# Altium project H05R2x.PrjPcb (part 2 of 2)

## Sheet H05R2x_Frontend 1.SchDoc
size Letter; CompanyName: Hexabitz; DocumentNumber: 2; SheetNumber: 2; SheetTotal: 3
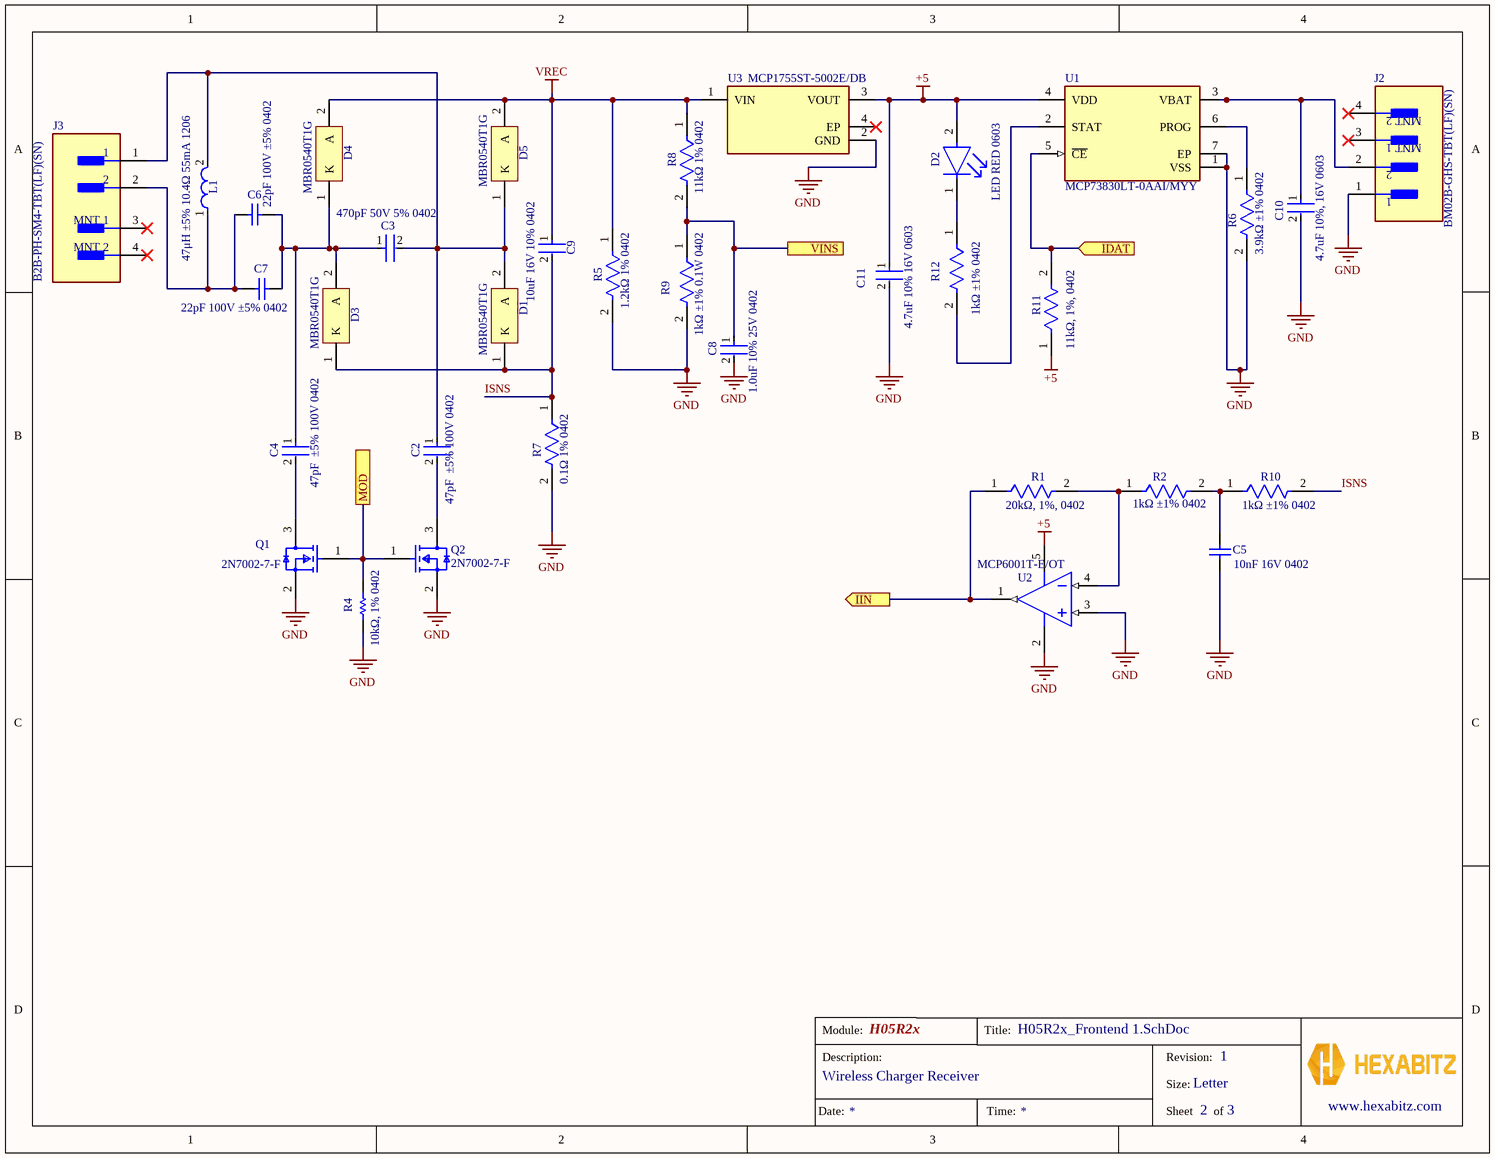
[diagram p1: H05R2x_Frontend 1.SchDoc]

### Parts
C2  47pF  ±5% 100V 0402  [FP-GQM155-0_05-IPC_A]
C3  470pF 50V 5% 0402  [FP-C0402-BB-MFG]
C4  47pF  ±5% 100V 0402  [FP-GQM155-0_05-IPC_A]
C5  10nF 16V 0402  [CAPC1005X60X26LL10T16]
C6  22pF 100V ±5% 0402  [CAPC1005X61X26LL10T16]
C7  22pF 100V ±5% 0402  [CAPC1005X61X26LL10T16]
C8  1.0uF 10% 25V 0402  [FP-GRM155-0_05-IPC_C]
C9  10uF 16V 10% 0402  [FP-GRM21B-0_1-IPC_B]
C10  4.7uF 10%, 16V 0603  [FP-GRM188-0_2-IPC_A]
C11  4.7uF 10% 16V 0603  [FP-GRM188-0_2-IPC_A]
D1  MBR0540T1G  [ONSC-SOD-123-2-425-04_V]
D2  LED RED 0603  [FP-6_541-5092_01-4-MFG]
D3  MBR0540T1G  [ONSC-SOD-123-2-425-04_V]
D4  MBR0540T1G  [ONSC-SOD-123-2-425-04_V]
D5  MBR0540T1G  [ONSC-SOD-123-2-425-04_V]
J2  BM02B-GHS-TBT(LF)(SN)  [FP-BM02B-GHS-TBT_LF_SN-MFG]
J3  B2B-PH-SM4-TBT(LF)(SN)  [FP-B2B-PH-SM4-TBT_LF_SN-MFG]
L1  47μH ±5% 10.4Ω 55mA 1206  [FP-LQH31CN_03-MFG]
Q1  2N7002-7-F  [FP-SOT23-MFG]
Q2  2N7002-7-F  [FP-SOT23-MFG]
R1  20kΩ, 1%, 0402  [FP-TFCR0402-IPC_A]
R2  1kΩ ±1% 0402  [FP-RNCP0402-IPC_C]
R4  10kΩ, 1% 0402  [RESC1005X40X25LL10T10]
R5  1.2kΩ 1% 0402  [FP-MCS0402-IPC_C]
R6  3.9kΩ ±1% 0402  [FP-RN73R1E-IPC_C]
R7  0.1Ω 1% 0402  [FP-CSR0402-IPC_A]
R8  11kΩ 1% 0402  [FP-CRCW0402-e3-IPC_B]
R9  1kΩ ±1% 0.1W 0402  [FP-RNCP0402-IPC_C]
R10  1kΩ ±1% 0402  [FP-RNCP0402-IPC_C]
R11  11kΩ, 1%, 0402  [FP-CRCW0402-e3-IPC_B]
R12  1kΩ ±1% 0402  [FP-AC0402-IPC_C]
U1  MCP73830LT-0AAI/MYY  [FP-C04-078-IPC_C]
U2  MCP6001T-E/OT  [SOT-23-OT5_L]
U3  MCP1755ST-5002E/DB  [FP-C04-032-IPC_B]

### Ports
IDAT (in), IIN (out), MOD, VINS

### Nets
+5: C11.1 D2.2(A) R11.1 U1.4(VDD) U2.5(VDD) U3.3(VOUT)
GND: C5.2 C8.2 C10.2 C11.2 J2.1 Q1.2(S) Q2.2(S) R4.1 R5.2 R6.2 R7.2 R9.2 U1.1(VSS) U1.7(EP) U2.2(VSS) U2.3(VIN+) U3.2(GND)
VREC: C9.1 D4.2(A) D5.2(A) R5.1 R8.1 U3.1(VIN)
ISNS: C9.2 D1.1(K) D3.1(K) R7.1 R10.2
NetC2_1: C2.1 C3.2 D1.2(A) D5.1(K) J3.1 L1.2
NetC2_2: C2.2 Q2.3(D)
NetC3_1: C3.1 C4.1 C6.2 C7.2 D3.2(A) D4.1(K)
NetC4_2: C4.2 Q1.3(D)
NetC5_1: C5.1 R2.2 R10.1
NetC6_1: C6.1 C7.1 J3.2 L1.1
NetC8_1: C8.1 R8.2 R9.1 ; port VINS
NetC10_1: C10.1 J2.2 U1.3(VBAT)
NetD2_1: D2.1(C) R12.1
NetQ1_1: Q1.1(G) Q2.1(G) R4.2 ; port MOD
NetR1_1: R1.1 U2.1(VOUT) ; port IIN
NetR1_2: R1.2 R2.1 U2.4(VIN-)
NetR6_1: R6.1 U1.6(PROG)
NetR11_2: R11.2 U1.5(~{CE}) ; port IDAT
NetR12_2: R12.2 U1.2(STAT)

Not connected (* = marked no-connect by the designer): J2 3(MNT_1)* 4(MNT_2)*; J3 3(MNT_1)* 4(MNT_2)*; U3 4(EP)*

### Notes on the sheet
- Module:
- Title:
- Description:
- Size:
- Revision:
- Letter
- www.hexabitz.com
- Date:
- Time:
- Sheet
- of

### Library data of the parts
C2 C4 = CMP-06035-010628-1: Ceramic Capacitor 47pF  ±5% 100VDC C0G 0402 Paper T/R; Min Operating Temperature: -55°C; Voltage Rating: 100V; Capacitance: 47pF; Dielectric: C0G; Length: 0.039inch; Mount: Surface Mount; Width: 0.02inch; Voltage Rating (DC): 100V; Thickness: 0.022inch; Packaging: Tape and Reel; Case/Package: 0402; Max Operating Temperature: 125°C; Tolerance: 5%
C3 = CMP-03020-013778-2: C0402 470 pF C0G 0.05 50 V; Manufacturer Part Number: C0402C471J5GAC; Manufacturer: Kemet; Material: Ceramic; Tolerance: 0.05; Package: C0402-BB; Value: 470 pF; Device Class L3: Ceramic Capacitors; Capacitance: 470 pF; Temperature Range High: +125°C; Temperature: -55°C to +125°C; Temperature Range Low: -55°C; ComponentLink2Description: Datasheet; Device Class L2: Capacitors; Lead Free: Yes; Category: Cap; Automotive: No; Height: 0.55mm; Ipc Land Pattern Name: CAPC10050X50; Device Class L1: Passive Components; ComponentLink2URL: https://content.kemet.com/datasheets/KEM_C1002_X7R_SMD.pdf; Voltage Rating: 50 V; RoHS: TRUE; Temperature Characteristic: C0G; Octopart: https://octopart.com/c0402c471j5gac-kemet-29626191; Mouser Description: Cap Ceramic 470pF 50V C0G 5% Pad SMD 0402 125C Bulk
C5 = CMP-2008-02025-1: Manufacturer: Vitramon; Part Number: VJ0402Y103KXJAC
C6 C7 = CMP-2008-02000-1: VJ0402D220JXBAJ; Manufacturer: Vitramon; Part Number: VJ0402D220JXBAJ
C8 = CMP-06035-057649-1: Chip Multilayer Ceramic Capacitors for General Purpose, 0402, 1.0uF, B, 10%, 10%, 25V; Capacitance: 1uF; Length: 1mm; Width: 500um; Thickness: 500um; Voltage Rating (DC): 25V; Tolerance: 10%
C9 = CMP-2007-03503-2: Chip Multilayer Ceramic Capacitors for General Purpose, 0805, 10uF, X6S, 22%, 10%, 16V; Capacitance: 10uF; Termination: SMD/SMT; Min Operating Temperature: -55°C; REACH SVHC: No SVHC; Voltage: 16V; Thickness: 0.053inch; Voltage Rating (DC): 16V; Lead Free: Lead Free; Tolerance: 10%; Packaging: Tape and Reel; Package Quantity: 3000; Max Operating Temperature: 105°C; Height: 1.25mm; Case Code (Metric): 2012; Case Code (Imperial): 0805; Dielectric: X6S; Weight: 0.000335oz; Depth: 1.25mm; Width: 0.049inch; Voltage Rating: 16V; Case/Package: 0805; Mount: Surface Mount; Length: 2mm
C10 C11 = CMP-06035-002362-1: Chip Multilayer Ceramic Capacitors for General Purpose, 0603, 4.7uF, X7S, 22%, 10%, 16V; Capacitance: 4.7uF; Dielectric: X7S; Voltage Rating (DC): 16V; Thickness: 800um; Tolerance: 10%; Length: 1.6mm; Width: 800um
D1 D3-D5 = CMP-1055-00401-1: Schottky Power Rectifier, 2-Pin SOD-123, Pb-Free, Tape and Reel; Manufacturer: On Semiconductor; IFSM Max (A): 5.5; Configuration: Single; ComponentLink1URL: http://www.onsemi.com/; ComponentLink3Description: Package Specification; RoHS: TRUE; PackageVersion: Rev. G, 10/2009; DatasheetVersion: Rev. 7; ComponentLink3URL: http://www.onsemi.com/pub_link/Collateral/425-04.PDF; Packing: Tape and Reel; ComponentLink1Description: Manufacturer URL; PackageDescription: 2-Pin SOD, Body 1.6 x 2.69 mm; PartNumber: MBR0540T1G; ComponentLink2Description: Datasheet; ComponentLink2URL: http://www.onsemi.cn/pub_link/Collateral/MBR0540T1-D.PDF; PackageReference: SOD-123-2-425-04; Mounting Technology: Surface Mount
D2 = CMP-02520-000012-1: LED RED 0603 SMD; Manufacturer: Vishay; Manufacturer Part Number: VLMS1300-GS08; Forward Voltage: 2V; Reverse Voltage: 5V; Power Dissipation: 75mW; Forward Current: 20mA; Luminous Intensity: 54mcd; Led Orientation: Top View; Peak Emmision Wavelength: 639nm; Viewing Angle: 130°; Wavelength: 631nm; Digikey Description: LED RED 0603 SMD; Height: 1mm; Colour: Red; Ambient Temperature Range High: +85°C; Ambient Temperature Range Low: -35°C; Package: 6.541-5092.01-4; Automotive: No; Temperature Range High: +85°C; Device Class L3: unset; Lead Free: Yes; Temperature Range Low: -35°C; Temperature: -35°C to +85°C; Device Class L2: LEDs; ComponentLink2Description: Datasheet; Octopart: https://octopart.com/vlms1300-gs08-vishay-21709201; Device Class L1: Optoelectronics; RoHS: TRUE; ComponentLink2URL: http://www.vishay.com/docs/82437/vlmo1300.pdf; Mouser Description: Standard LEDs - SMD Super Red Clear Non-Diff; Category: Diode
J2 = CMP-17439-000221-2: CONN HEADER SMD 2POS 1.25MM; NexarPartId: 289277; Current Rating: 1A; Number of Positions: 2; Voltage Rating: 50V; Wire/Cable Gauge: 26AWG; Voltage Rating (AC): 50V; Number of Rows: 1; Housing Color: Natural; Pitch: 1.25mm; Contact Material: Copper, Tin; Number of Contacts: 2; REACH SVHC: No SVHC; Min Operating Temperature: -25°C; Housing Material: Nylon; Contact Plating: Tin; Termination: SMD/SMT; Orientation: Straight; Packaging: Cut Tape; RoHS: Compliant; Height: 4.05mm; Lead Free: Lead Free; Lead Pitch: 1.25mm; Max Operating Temperature: 85°C
J3 = CMP-17439-000005-1: CONN HEADER SMD 2POS 2MM; Manufacturer: JST; Current Rating: 2A; Conn Gender: Male; Voltage Rating: 100V; Description: Connector Header Surface Mount 2 position 0.079" (2.00mm); Conn Orientation: Vertical; Number Of Contacts: 2; Octopart: https://octopart.com/b2b-ph-sm4-tbt%28lf%29%28sn%29-jst-7877930; Number Of Rows: 1; Device Class L2: Headers and Wire Housings; RoHS: TRUE; Contact Material: Tin,Copper; Height: 6.65mm; Temperature: -25°C to +85°C; Temperature Range Low: -25°C; ComponentLink2Description: Datasheet; Manufacturer Part Number: B2B-PH-SM4-TBT(LF)(SN); ComponentLink2URL: http://www.jst-mfg.com/product/pdf/eng/ePH.pdf; Automotive: No; Pitch: 2mm; Lead Free: Yes; Device Class L3: unset; Category: Conn; Digikey Description: CONN HEADER SMD 2POS 2MM; Temperature Range High: +85°C; Package: 0; Device Class L1: Connectors
L1 = CMP-06042-003344-1: Wire Wound Ferrite Inductor for General Circuits 47μH ±5% 10.4Ω 55mA 1206; Shielding: Unshielded; Inductance: 47uH; Self Resonant Frequency: 10MHz; Q Factor: 40; DC Resistance (DCR): 8R; Test Frequency: 1MHz; Tolerance: 5%; Case Code (Imperial): 1206; Max Operating Temperature: 85°C; Min Operating Temperature: -40°C; Military Standard: Not; DC Current: 55mA; Height - Seated (Max): 0.079inch; Width: 0.063inch; Radiation Hardening: No; Mount: Surface Mount; Case/Package: 1206; Core Material: Ferrite; Packaging: Tape and Reel; Case Code (Metric): 3216; Weight: 0.001023oz; Current Rating: 55mA; Height: 1.8mm; Termination: SMD/SMT; Package Quantity: 2000; Length: 0.126inch; Resistor Type: Wirewound; Max DC Current: 55mA; Depth: 1.8mm
Q1 Q2 = CMP-2000-04929-2: MOSFET N-CH 60V 115MA SOT23-3; Turn-On Delay Time: 7ns; Turn-Off Delay Time: 11ns; Drain to Source Resistance: 7.5R; Rise Time: 3ns; Drain to Source Breakdown Voltage: 70V; Input Capacitance: 50pF; Number of Elements: 1; Power Dissipation: 540mW; Max Power Dissipation: 300mW; Fall Time: 5.6ns; Gate to Source Voltage (Vgs): 20V; Threshold Voltage: 2.5V; Element Configuration: Single; Termination: SMD/SMT; Weight: 0.000282oz; Radiation Hardening: No; Max Operating Temperature: 150°C; On-State Resistance: 7.5R; Mount: Surface Mount; Current Rating: 115mA; Contact Plating: Tin; Lead Free: Lead Free; Min Operating Temperature: -55°C; Number of Pins: 3; REACH SVHC: No SVHC; Drain to Source Voltage (Vdss): 60V; Width: 1.3mm; Package Quantity: 3000; Length: 2.9mm; Case/Package: SOT-23; Number of Channels: 1; Dual Supply Voltage: 60V; Packaging: Tape and Reel; Height: 1mm; Voltage Rating (DC): 60V; Nominal Vgs: 2.5V; Continuous Drain Current (ID): 115mA; Voltage: 60V; Rds On Max: 7.5R
R1 = CMP-250906-149647-1: RES Thin Film,  20kΩ, 1%, 0.063W, 50ppm/°C, 0402
R2 R9 R10 = CMP-26527-002183-1: 1kΩ ±1% 0.1W 0402 High Power Anti-Sulfur Thin Film Chip Resistor; Mount: Surface Mount; Tolerance: 1%; Min Operating Temperature: -55°C; Max Operating Temperature: 155°C
R4 = CMP-2002-04584-1: Manufacturer: KOA Speer; Part Number: SG73P1ETTP1002F
R5 = CMP-02407-004026-1: RES SMD 1.2K OHM 1% 1/10W 0402; Max Power Dissipation: 100mW; Resistance: 820R; Temperature Coefficient: 50ppm/°C; Width: 0.02inch; Min Operating Temperature: -55°C; Contact Plating: Tin; Height: 0.015inch; Case/Package: 0402; Length: 0.039inch; Military Standard: Not; Package Quantity: 10000; Lead Free: Lead Free; Radiation Hardening: No; Max Operating Temperature: 125°C; Depth: 0.5mm; Composition: Thin Film; Tolerance: 1%; Packaging: Tape and Reel; Number of Terminations: 2
R6 = CMP-04015-061446-1: 3.9kΩ ±1% 0.063W, 1/16W Chip Resistor 0402 (1005 Metric) Moisture Resistant Thin Film
R7 = CMP-26527-000729-1: General Purpose Thick Film Chip Resistor, 0402, 0.1Ω, 1%, 200ppm/°C, 0.125W; Resistance: 100mR; Max Power Dissipation: 125mW; Case/Package: 0402; Series: CSR; Length: 0.039inch; Width: 0.02inch; Max Operating Temperature: 155°C; Packaging: Tape and Reel; RoHS Compliant: Yes; Mount: Surface Mount; Resistor Type: Thick Film; Contact Plating: Tin; Tolerance: 1%; Package Quantity: 10000; Min Operating Temperature: -55°C; Height: 0.017inch; Number of Terminations: 2; Radiation Hardening: No; Temperature Coefficient: 200ppm/°C
R8 R11 = CMP-02407-002513-1: RES Thick Film, 11kΩ, 1%, 0.063W, 100ppm/°C, 0402; Max Power Dissipation: 63mW; Resistance: 11kR; Composition: Thick Film; Min Operating Temperature: -55°C; Features: Automotive AEC-Q200; Packaging: Tape and Reel; Lead Free: Lead Free; Length: 0.039inch; Tolerance: 1%; Case/Package: 0402; Temperature Coefficient: 100ppm/°C; Max Operating Temperature: 155°C; Package Quantity: 50000; Width: 0.02inch; Height: 0.016inch; Number of Terminations: 2
R12 = CMP-03412-047873-1: RES 1kΩ ±1% 0.063W 0402; RoHS Compliant: Yes
U1 = CMP-06318-000013-1: IC BATT CHG LI-ION 1CELL 6TDFN; Max Supply Voltage: 6V; Min Supply Voltage: 3.75V; Max Operating Temperature: 125°C; Packaging: Tape and Reel; Lead Free: Lead Free; Radiation Hardening: No; Package Quantity: 3000; Mount: Surface Mount; RoHS Compliant: Yes; Number of Pins: 6; Min Operating Temperature: -40°C
U2 = CMP-0187-00458-3: None; Output Current: 23mA; Number of Circuits: 1; Input Offset Voltage-Max: 4.5mV; Nominal Supply Current: 100uA; Min Supply Voltage: 1.8V; Voltage: 6V; Operating Supply Voltage: 5.5V; Gain Bandwidth Product: 1MHz; Amplifier Type: GENERAL PURPOSE; Voltage Gain: 112dB; Slew Rate: 0.6V/µs; Power Supply Rejection Ratio (PSRR): 86dB; Input Bias Current: 1pA; Common Mode Rejection Ratio: 60dB; Package Quantity: 3000; Lead Free: Lead Free; Case/Package: SOT-23; Max Operating Temperature: 125°C; RoHS Compliant: Yes; Radiation Hardening: No; Number of Channels: 1; Length: 3.1mm; Height: 1.3mm; Output Current per Channel: 23mA; Supply Current: 100uA; Packaging: Tape and Reel; Technology: CMOS; Number of Elements: 1; Number of Pins: 5; Input Offset Voltage (Vos): 4.5mV; Width: 1.8mm; Contact Plating: Tin; Mount: Surface Mount; Slew Rate-Nom: 0.6V/µs; Unity Gain Bandwidth Product: 1MHz; REACH SVHC: No SVHC; Number of Amplifiers: 1; Max Supply Voltage: 6V; Operating Supply Current: 100uA; Min Operating Temperature: -40°C; Bandwidth: 1MHz
U3 = CMP-06324-000149-1: IC REG LINEAR 5V 300MA SOT223-3; Supply Current: 68uA; Polarity: Positive; Min Output Voltage: 3.3V; Dropout Voltage: 300mV; Accuracy: 2%; Output Type: Fixed; Power Supply Rejection Ratio (PSRR): 80dB; Number of Outputs: 1; Max Input Voltage: 16V; Min Input Voltage: 3.6V; Quiescent Current: 100uA; Output Voltage: 5V; Reach SVHC Compliant: Yes; Width: 3.7mm; Max Operating Temperature: 125°C; Lead Free: Lead Free; Mount: Surface Mount; Min Operating Temperature: -40°C; Case/Package: SOT-223-3; Output Current: 300mA; Nominal Output Voltage: 5V; Height: 1.7mm; Max Output Current: 300mA; Packaging: Tape and Reel; Number of Regulators: 1; RoHS Compliant: Yes; Package Quantity: 1; Length: 6.7mm; Nominal Supply Current: 68uA; Number of Pins: 3

## Nets that join several sheets
GND: H05R2x_Backend (17 pins), H05R2x_Frontend 1 (17 pins)
NetC8_1: H05R2x_Backend (U4.16), H05R2x_Frontend 1 (C8.1 R8.2 R9.1)
NetQ1_1: H05R2x_Backend (U4.17), H05R2x_Frontend 1 (Q1.1 Q2.1 R4.2)
NetR1_1: H05R2x_Backend (U4.15), H05R2x_Frontend 1 (R1.1 U2.1)
NetR11_2: H05R2x_Backend (U4.20), H05R2x_Frontend 1 (R11.2 U1.5)